# Altium schematic sheet MC3_module.SchDoc
size Letter; Organization: Altium Limited; Address1: L3, 12a Rodborough Rd; Address2: Frenchs Forest; Address3: NSW; Address4: Australia 2086; DocumentNumber: D_5; SheetNumber: 5; SheetTotal: 21
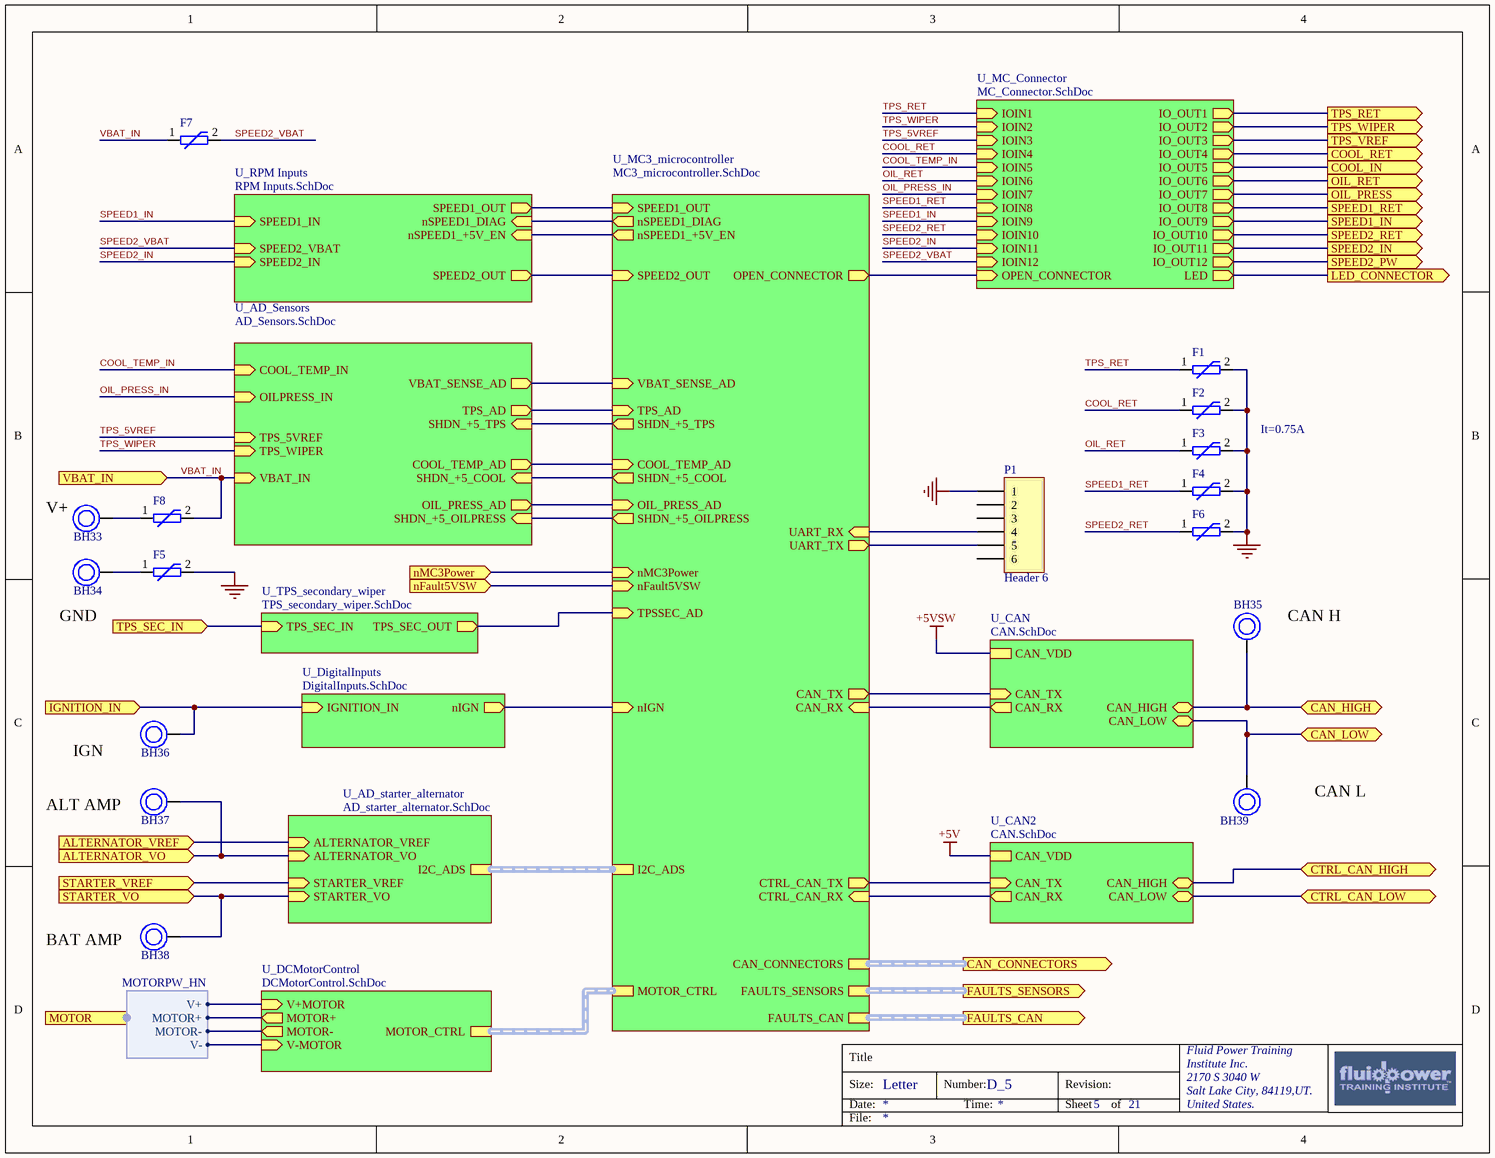
[diagram p0: MC3_module.SchDoc]

## Parts
BH33  BananaHole  [BananaHole]  (value not drawn)  (no BOM)
BH34  BananaHole  [BananaHole]  (value not drawn)  (no BOM)
BH35  BananaHole  [BananaHole]  (value not drawn)  (no BOM)
BH36  BananaHole  [BananaHole]  (value not drawn)  (no BOM)
BH37  BananaHole  [BananaHole]  (value not drawn)  (no BOM)
BH38  BananaHole  [BananaHole]  (value not drawn)  (no BOM)
BH39  BananaHole  [BananaHole]  (value not drawn)  (no BOM)
F1  It=0.75A  [0ZCJ0035AF2E_FUSE]
F2  It=0.75A  [0ZCJ0035AF2E_FUSE]  (value not drawn)
F3  It=0.75A  [0ZCJ0035AF2E_FUSE]  (value not drawn)
F4  It=0.75A  [0ZCJ0035AF2E_FUSE]  (value not drawn)
F5  It=0.75A  [0ZCJ0035AF2E_FUSE]  (value not drawn)
F6  It=0.75A  [0ZCJ0035AF2E_FUSE]  (value not drawn)
F7  It=0.75A  [0ZCJ0035AF2E_FUSE]  (value not drawn)
F8  It=0.75A  [0ZCJ0035AF2E_FUSE]  (value not drawn)
P1  Header 6  [HDR1X6]  (no BOM)

## Sub-sheets
U_AD_Sensors = AD_Sensors.SchDoc: VBAT_SENSE_AD (out), TPS_AD (out), SHDN_+5_TPS (in), COOL_TEMP_AD (out), SHDN_+5_OILPRESS (in), SHDN_+5_COOL (in), OIL_PRESS_AD (out), COOL_TEMP_IN (in), OILPRESS_IN (in), TPS_5VREF (in), TPS_WIPER (in), VBAT_IN (in)
U_AD_starter_alternator = AD_starter_alternator.SchDoc: ALTERNATOR_VO (in), ALTERNATOR_VREF (in), STARTER_VREF (in), STARTER_VO (in), I2C_ADS (harness I2C_ADS)
U_CAN = CAN.SchDoc: CAN_TX (in), CAN_RX (out), CAN_VDD, CAN_HIGH (bidir), CAN_LOW (bidir)
U_CAN2 = CAN.SchDoc: CAN_TX (in), CAN_RX (out), CAN_VDD, CAN_HIGH (bidir), CAN_LOW (bidir)
U_DCMotorControl = DCMotorControl.SchDoc: V+MOTOR (in), V-MOTOR (in), MOTOR+ (out), MOTOR- (out), MOTOR_CTRL (harness MOTOR_HN)
U_DigitalInputs = DigitalInputs.SchDoc: nIGN (out), IGNITION_IN (in)
U_MC3_microcontroller = MC3_microcontroller.SchDoc: nSPEED1_+5V_EN (out), SHDN_+5_OILPRESS (out), SHDN_+5_COOL (out), COOL_TEMP_AD (in), CAN_RX (in), VBAT_SENSE_AD (in), TPS_AD (in), SPEED1_OUT (in), nIGN (in), SPEED2_OUT (in), nSPEED1_DIAG (out), UART_RX (in), SHDN_+5_TPS (out), CAN_TX (out), OIL_PRESS_AD (in), UART_TX (out), I2C_ADS (harness I2C_ADS), MOTOR_CTRL (harness MOTOR_HN), CAN_CONNECTORS (harness CONNECTORS_HN), nMC3Power (in), TPSSEC_AD (in), nFault5VSW (in), OPEN_CONNECTOR (out), CTRL_CAN_TX (out), CTRL_CAN_RX (in), FAULTS_CAN (harness FAULTSCAN_HN), FAULTS_SENSORS (harness FAULTSSENSORS_HN)
U_MC_Connector = MC_Connector.SchDoc: IOIN1 (in), IOIN2 (in), IOIN3 (in), IOIN4 (in), IOIN5 (in), IOIN6 (in), IOIN7 (in), IOIN8 (in), IOIN9 (in), IOIN10 (in), IOIN11 (in), IOIN12 (in), IO_OUT1 (out), IO_OUT2 (out), IO_OUT3 (out), IO_OUT4 (out), IO_OUT5 (out), IO_OUT6 (out), IO_OUT7 (out), IO_OUT8 (out), IO_OUT9 (out), IO_OUT10 (out), IO_OUT11 (out), IO_OUT12 (out), OPEN_CONNECTOR (in), LED (out)
U_RPM Inputs = RPM Inputs.SchDoc: nSPEED1_DIAG (in), SPEED1_IN (in), nSPEED1_+5V_EN (in), SPEED1_OUT (out), SPEED2_OUT (out), SPEED2_VBAT (in), SPEED2_IN (in)
U_TPS_secondary_wiper = TPS_secondary_wiper.SchDoc: TPS_SEC_OUT (out), TPS_SEC_IN (in)

## Ports
ALTERNATOR_VO (in), ALTERNATOR_VREF (in), CAN_CONNECTORS (out, harness CONNECTORS_HN), CAN_HIGH (bidir), CAN_LOW (bidir), COOL_IN (out), COOL_RET (out), CTRL_CAN_HIGH (bidir), CTRL_CAN_LOW (bidir), FAULTS_CAN (out, harness FAULTSCAN_HN), FAULTS_SENSORS (out, harness FAULTSSENSORS_HN), IGNITION_IN (in), LED_CONNECTOR (out), MOTOR (out, harness MOTORPW_HN), nFault5VSW (in), nMC3Power (in), OIL_PRESS (out), OIL_RET (out), SPEED1_IN (out), SPEED1_RET (out), SPEED2_IN (out), SPEED2_PW (out), SPEED2_RET (out), STARTER_VO (in), STARTER_VREF (in), TPS_RET (out), TPS_SEC_IN (in), TPS_VREF (out), TPS_WIPER (out), VBAT_IN (in)

## Harnesses
MOTORPW_HN: V+, MOTOR+, MOTOR-, V-

## Nets
+5V: sheet U_CAN2/CAN_VDD
+5VSW: sheet U_CAN/CAN_VDD
GND: F1.2 F2.2 F3.2 F4.2 F5.2 F6.2 P1.1
ALTERNATOR_VO: BH37.1 ; port ALTERNATOR_VO, sheet U_AD_starter_alternator/ALTERNATOR_VO
ALTERNATOR_VREF: port ALTERNATOR_VREF, sheet U_AD_starter_alternator/ALTERNATOR_VREF
CAN_HIGH: BH35.1 ; port CAN_HIGH, sheet U_CAN/CAN_HIGH
CAN_LOW: BH39.1 ; port CAN_LOW, sheet U_CAN/CAN_LOW
COOL_IN: port COOL_IN, sheet U_MC_Connector/IO_OUT5
COOL_RET: F2.1 ; sheet U_MC_Connector/IOIN4
COOL_RET: port COOL_RET, sheet U_MC_Connector/IO_OUT4  [a separate net that carries the same name]
COOL_TEMP_IN: sheet U_AD_Sensors/COOL_TEMP_IN, sheet U_MC_Connector/IOIN5
CTRL_CAN_HIGH: port CTRL_CAN_HIGH, sheet U_CAN2/CAN_HIGH
CTRL_CAN_LOW: port CTRL_CAN_LOW, sheet U_CAN2/CAN_LOW
IGNITION_IN: BH36.1 ; port IGNITION_IN, sheet U_DigitalInputs/IGNITION_IN
LED_CONNECTOR: port LED_CONNECTOR, sheet U_MC_Connector/LED
nFault5VSW: port nFault5VSW, sheet U_MC3_microcontroller/nFault5VSW
nMC3Power: port nMC3Power, sheet U_MC3_microcontroller/nMC3Power
OIL_PRESS: port OIL_PRESS, sheet U_MC_Connector/IO_OUT7
OIL_PRESS_IN: sheet U_AD_Sensors/OILPRESS_IN, sheet U_MC_Connector/IOIN7
OIL_RET: F3.1 ; sheet U_MC_Connector/IOIN6
OIL_RET: port OIL_RET, sheet U_MC_Connector/IO_OUT6  [a separate net that carries the same name]
SPEED1_IN: sheet U_RPM Inputs/SPEED1_IN, sheet U_MC_Connector/IOIN9
SPEED1_IN: port SPEED1_IN, sheet U_MC_Connector/IO_OUT9  [a separate net that carries the same name]
SPEED1_RET: F4.1 ; sheet U_MC_Connector/IOIN8
SPEED1_RET: port SPEED1_RET, sheet U_MC_Connector/IO_OUT8  [a separate net that carries the same name]
SPEED2_IN: sheet U_RPM Inputs/SPEED2_IN, sheet U_MC_Connector/IOIN11
SPEED2_IN: port SPEED2_IN, sheet U_MC_Connector/IO_OUT11  [a separate net that carries the same name]
SPEED2_PW: port SPEED2_PW, sheet U_MC_Connector/IO_OUT12
SPEED2_RET: F6.1 ; sheet U_MC_Connector/IOIN10
SPEED2_RET: port SPEED2_RET, sheet U_MC_Connector/IO_OUT10  [a separate net that carries the same name]
SPEED2_VBAT: F7.2 ; sheet U_RPM Inputs/SPEED2_VBAT, sheet U_MC_Connector/IOIN12
STARTER_VO: BH38.1 ; port STARTER_VO, sheet U_AD_starter_alternator/STARTER_VO
STARTER_VREF: port STARTER_VREF, sheet U_AD_starter_alternator/STARTER_VREF
TPS_5VREF: sheet U_AD_Sensors/TPS_5VREF, sheet U_MC_Connector/IOIN3
TPS_RET: F1.1 ; sheet U_MC_Connector/IOIN1
TPS_RET: port TPS_RET, sheet U_MC_Connector/IO_OUT1  [a separate net that carries the same name]
TPS_SEC_IN: port TPS_SEC_IN, sheet U_TPS_secondary_wiper/TPS_SEC_IN
TPS_VREF: port TPS_VREF, sheet U_MC_Connector/IO_OUT3
TPS_WIPER: sheet U_AD_Sensors/TPS_WIPER, sheet U_MC_Connector/IOIN2
TPS_WIPER: port TPS_WIPER, sheet U_MC_Connector/IO_OUT2  [a separate net that carries the same name]
VBAT_IN: F7.1 F8.2 ; port VBAT_IN, sheet U_AD_Sensors/VBAT_IN
NetBH33_1: BH33.1 F8.1
NetBH34_1: BH34.1 F5.1
NetP1_4: P1.4 ; sheet U_MC3_microcontroller/UART_RX
NetP1_5: P1.5 ; sheet U_MC3_microcontroller/UART_TX
(unnamed): sheet U_CAN/CAN_TX, sheet U_MC3_microcontroller/CAN_TX
(unnamed): sheet U_CAN/CAN_RX, sheet U_MC3_microcontroller/CAN_RX
(unnamed): sheet U_MC3_microcontroller/nSPEED1_+5V_EN, sheet U_RPM Inputs/nSPEED1_+5V_EN
(unnamed): sheet U_MC3_microcontroller/SHDN_+5_OILPRESS, sheet U_AD_Sensors/SHDN_+5_OILPRESS
(unnamed): sheet U_MC3_microcontroller/SHDN_+5_COOL, sheet U_AD_Sensors/SHDN_+5_COOL
(unnamed): sheet U_MC3_microcontroller/COOL_TEMP_AD, sheet U_AD_Sensors/COOL_TEMP_AD
(unnamed): sheet U_MC3_microcontroller/VBAT_SENSE_AD, sheet U_AD_Sensors/VBAT_SENSE_AD
(unnamed): sheet U_MC3_microcontroller/TPS_AD, sheet U_AD_Sensors/TPS_AD
(unnamed): sheet U_MC3_microcontroller/SPEED1_OUT, sheet U_RPM Inputs/SPEED1_OUT
(unnamed): sheet U_MC3_microcontroller/nIGN, sheet U_DigitalInputs/nIGN
(unnamed): sheet U_MC3_microcontroller/SPEED2_OUT, sheet U_RPM Inputs/SPEED2_OUT
(unnamed): sheet U_MC3_microcontroller/nSPEED1_DIAG, sheet U_RPM Inputs/nSPEED1_DIAG
(unnamed): sheet U_MC3_microcontroller/SHDN_+5_TPS, sheet U_AD_Sensors/SHDN_+5_TPS
(unnamed): sheet U_MC3_microcontroller/OIL_PRESS_AD, sheet U_AD_Sensors/OIL_PRESS_AD
(unnamed): sheet U_MC3_microcontroller/TPSSEC_AD, sheet U_TPS_secondary_wiper/TPS_SEC_OUT
(unnamed): sheet U_MC3_microcontroller/OPEN_CONNECTOR, sheet U_MC_Connector/OPEN_CONNECTOR
(unnamed): sheet U_MC3_microcontroller/CTRL_CAN_TX, sheet U_CAN2/CAN_TX
(unnamed): sheet U_MC3_microcontroller/CTRL_CAN_RX, sheet U_CAN2/CAN_RX
(unnamed): sheet U_DCMotorControl/V+MOTOR, port MOTOR.V+
(unnamed): sheet U_DCMotorControl/V-MOTOR, port MOTOR.V-
(unnamed): sheet U_DCMotorControl/MOTOR+, port MOTOR.MOTOR+
(unnamed): sheet U_DCMotorControl/MOTOR-, port MOTOR.MOTOR-

Not connected (* = marked no-connect by the designer): P1 2 3 6

## Buses and harness runs
harness port CAN_CONNECTORS = sheet U_MC3_microcontroller/CAN_CONNECTORS
harness port FAULTS_CAN = sheet U_MC3_microcontroller/FAULTS_CAN
harness port FAULTS_SENSORS = sheet U_MC3_microcontroller/FAULTS_SENSORS
harness sheet U_AD_starter_alternator/I2C_ADS = sheet U_MC3_microcontroller/I2C_ADS
harness sheet U_DCMotorControl/MOTOR_CTRL = sheet U_MC3_microcontroller/MOTOR_CTRL

## Notes on the sheet
- (near BH33) V+
- (near BH34) GND
- (near BH35) CAN H
- IGN
- ALT AMP
- CAN L
- BAT AMP
- Title
- Size:
- Date:
- Letter
- Number:
- Time:
- Revision:
- Sheet
- of
- Fluid Power Training
- Institute Inc.
- 2170 S 3040 W
- Salt Lake City, 84119,UT.
- United States.
- File:

## Library data of the parts
BH33-BH39 = BananaHole: Banana hole for panel testing and board mounting
F1-F8 = 0ZCJ0035AF2E: PTC RESET FUSE 30V 350MA 1206; Manufacturer: Bel; Max Current Rating: 40A; Power Dissipation: 600mW; Trip Current: 750mA; Time to Trip: 0.1s; Approvals: UL,TUV; Supplier 1: Mouser; Supplier Part Number 1: 530-0ZCJ0035AF2E; Manufacturer Part Number: 0ZCJ0035AF2E; RoHS: Yes; Category: Fuses; Stock 1: 19724; Pricing 1: 1=0.17000, 10=0.16700, 25=0.15400, 100=0.11700, 250=0.10600, 500=0.09000 (USD); Mount: Surface Mount; Case/Package: 1206; Case Code (Metric): 3216; Case Code (Imperial): 1206; Contact Plating: Tin,Matte; Number of Terminals: 2; Min Operating Temperature: -40°C; Max Operating Temperature: 85°C; Package Quantity: 3000; Packaging: Tape and Reel; Hold Current: 350mA; Max Voltage Rating (DC): 30V; Lead Free: Lead Free; ComponentLink1URL: https://datasheet.ciiva.com/18550/0zcj-18550696.pdf?src-supplier=Digi-Key; ComponentLink1Description: https://datasheet.ciiva.com/18550/0zcj-18550696.pdf?src-supplier=Digi-Key; ComponentLink2URL: https://datasheet.ciiva.com/18550/0zcj-18550697.pdf?src-supplier=Digi-Key; ComponentLink2Description: https://datasheet.ciiva.com/18550/0zcj-18550697.pdf?src-supplier=Digi-Key
P1 = Header 6: Header, 6-Pin; LatestRevisionDate: 17-Jul-2002; LatestRevisionNote: Re-released for DXP Platform.; Publisher: Altium Limited